# Altium project shild_esp32s.PrjPcb
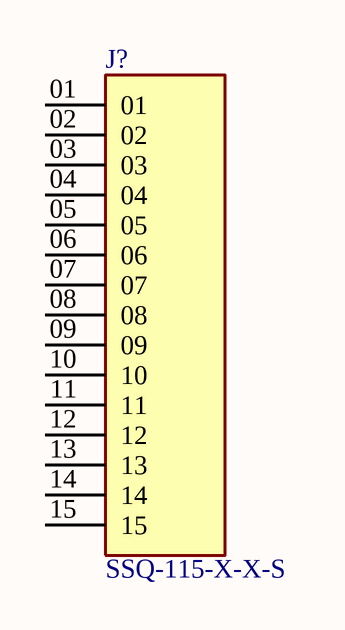
[diagram p0: Sheet1.SchDoc]
1 sheet, 1 parts. Net scope: global (net labels, ports and power ports of the same name join across sheets).
Board file: PCB1.PcbDoc

## Sheet Sheet1.SchDoc
size A; SheetNumber: 1; SheetTotal: 1

### Parts
J?  SSQ-115-X-X-S  [SAMTEC_SSQ-115-X-X-S]

### Nets

Not connected (* = marked no-connect by the designer): J? 01 02 03 04 05 06 07 08 09 10 11 12 13 14 15

### Library data of the parts
J? = SSQ-115-X-X-S: MF: {'manufacturer': u'Samtec'}; Price: None; Value: *; Package: None; Availability: Unavailable; MP: SSQ-115-X-X-S